# Altium schematic sheet 电气拓扑.SchDoc
size 1270 x 1270 mm; SheetNumber: 1; SheetTotal: 2
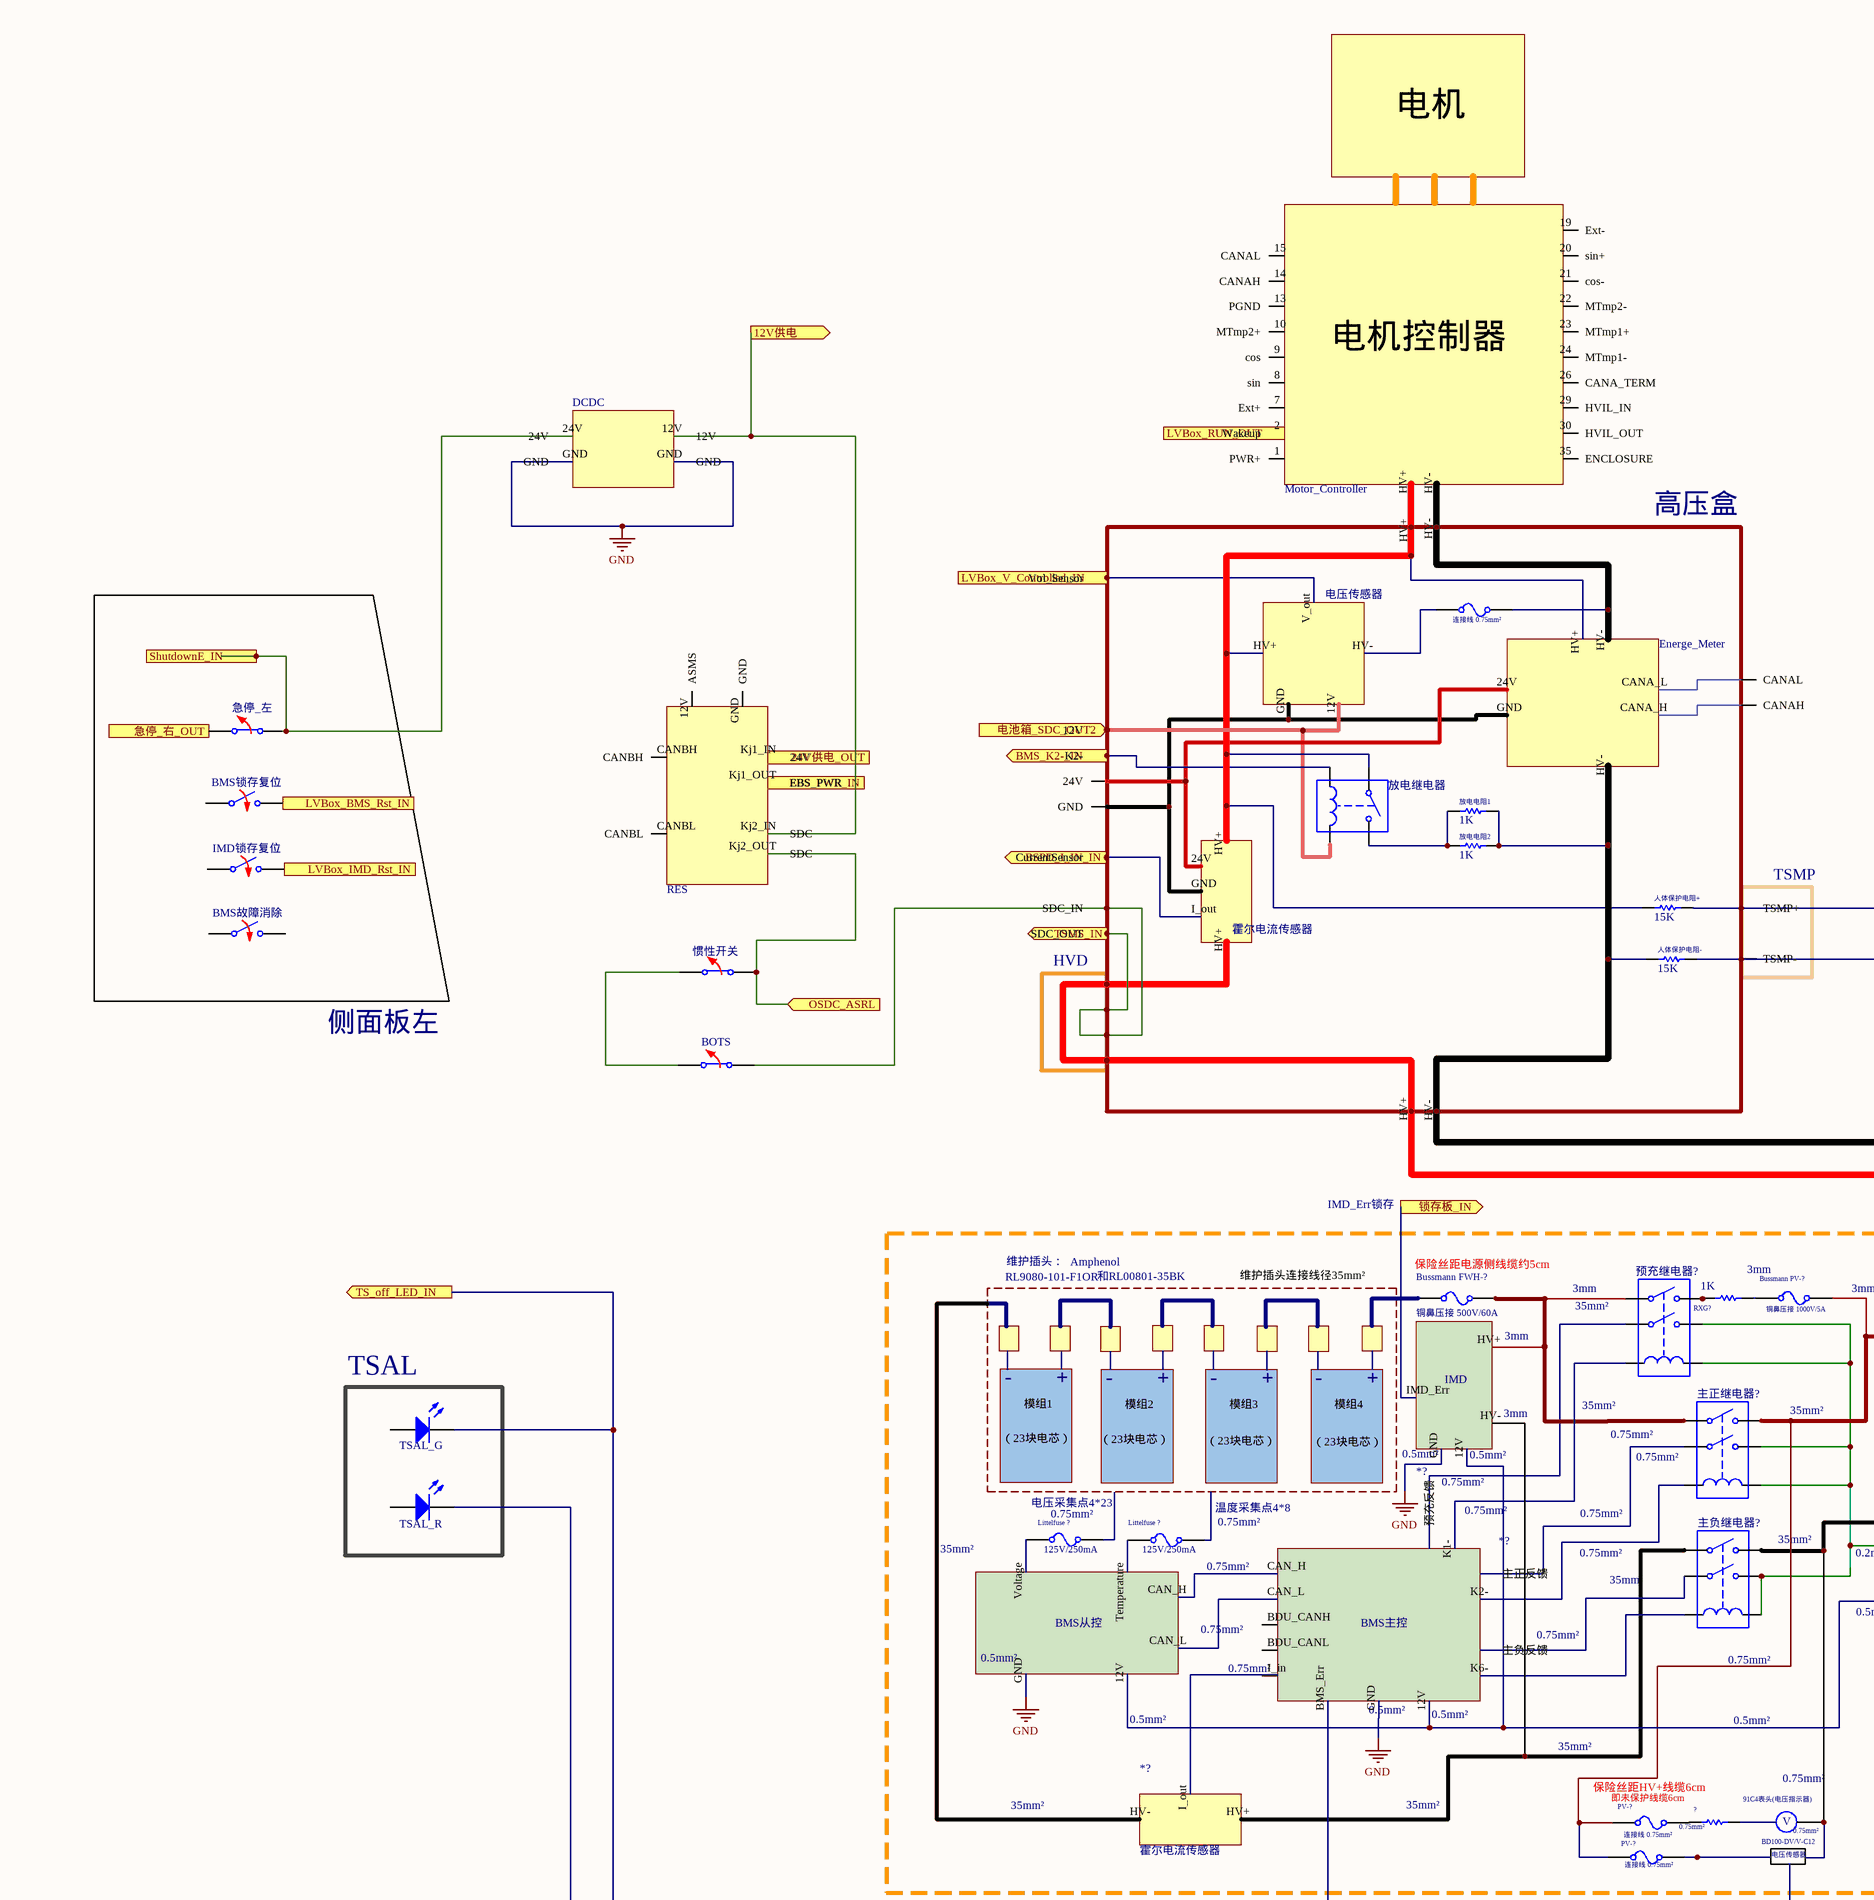
[diagram p0: 电气拓扑.SchDoc, top left]
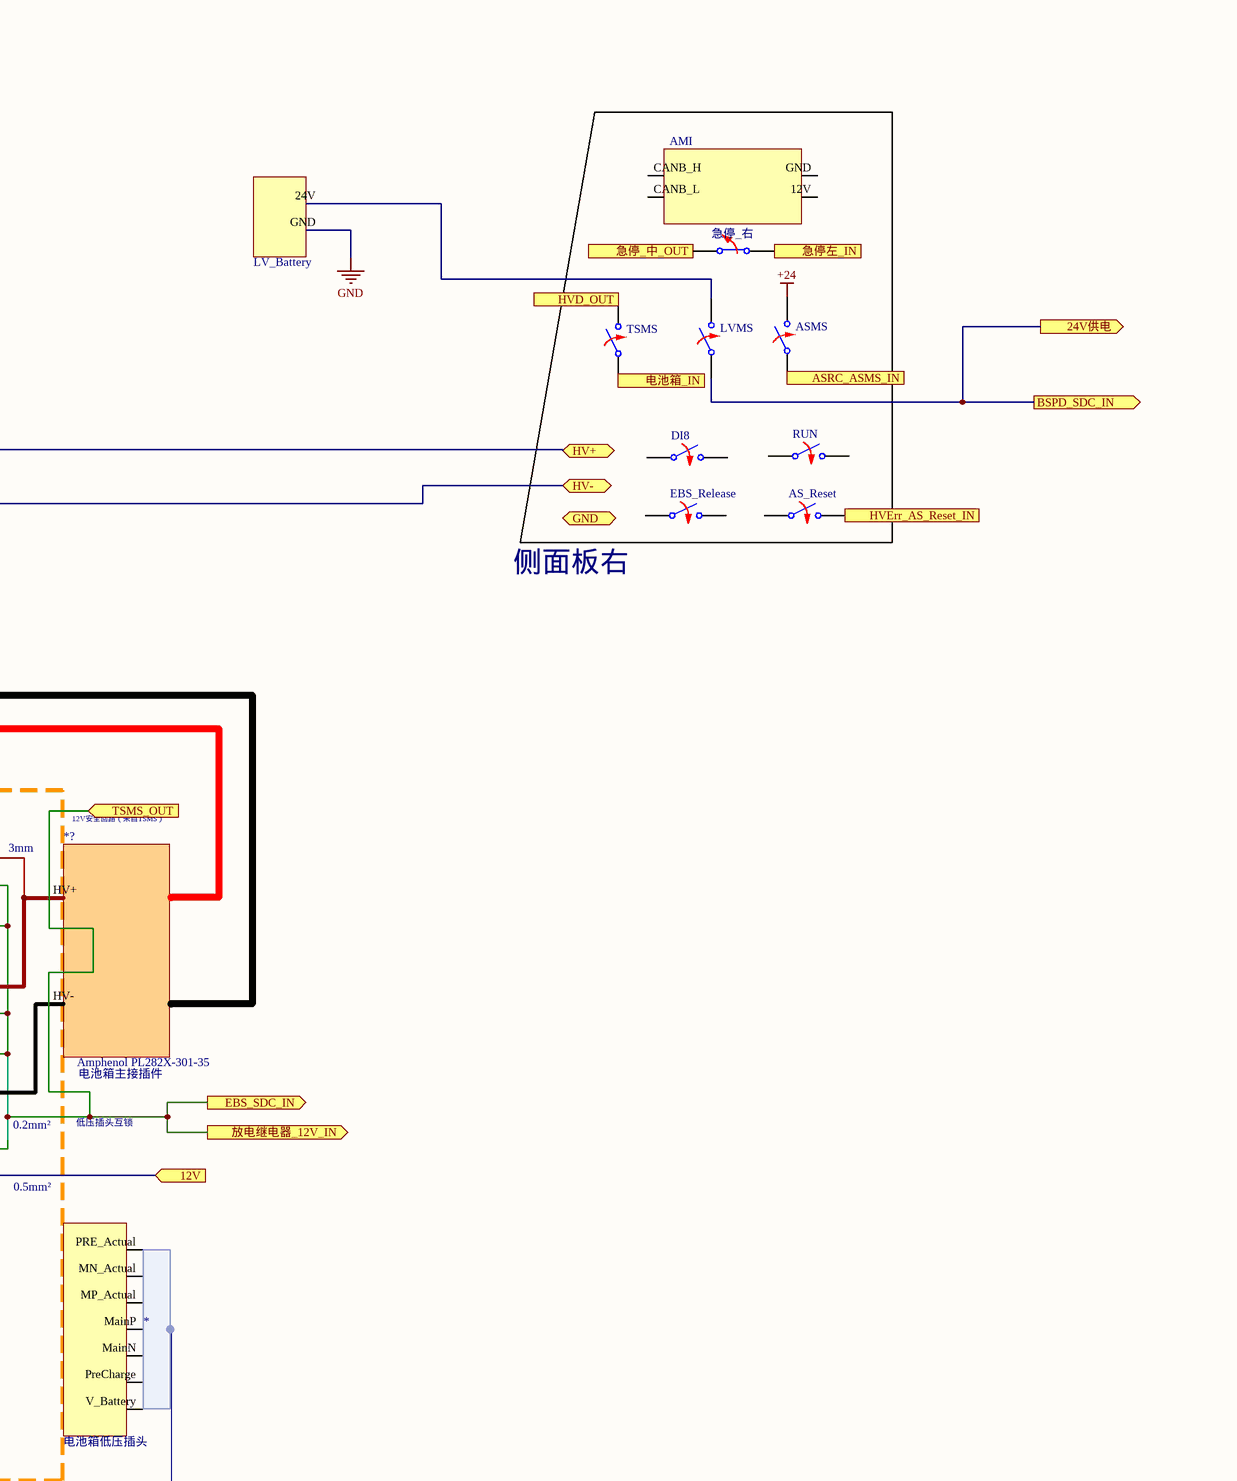
[diagram p1: 电气拓扑.SchDoc, top right]
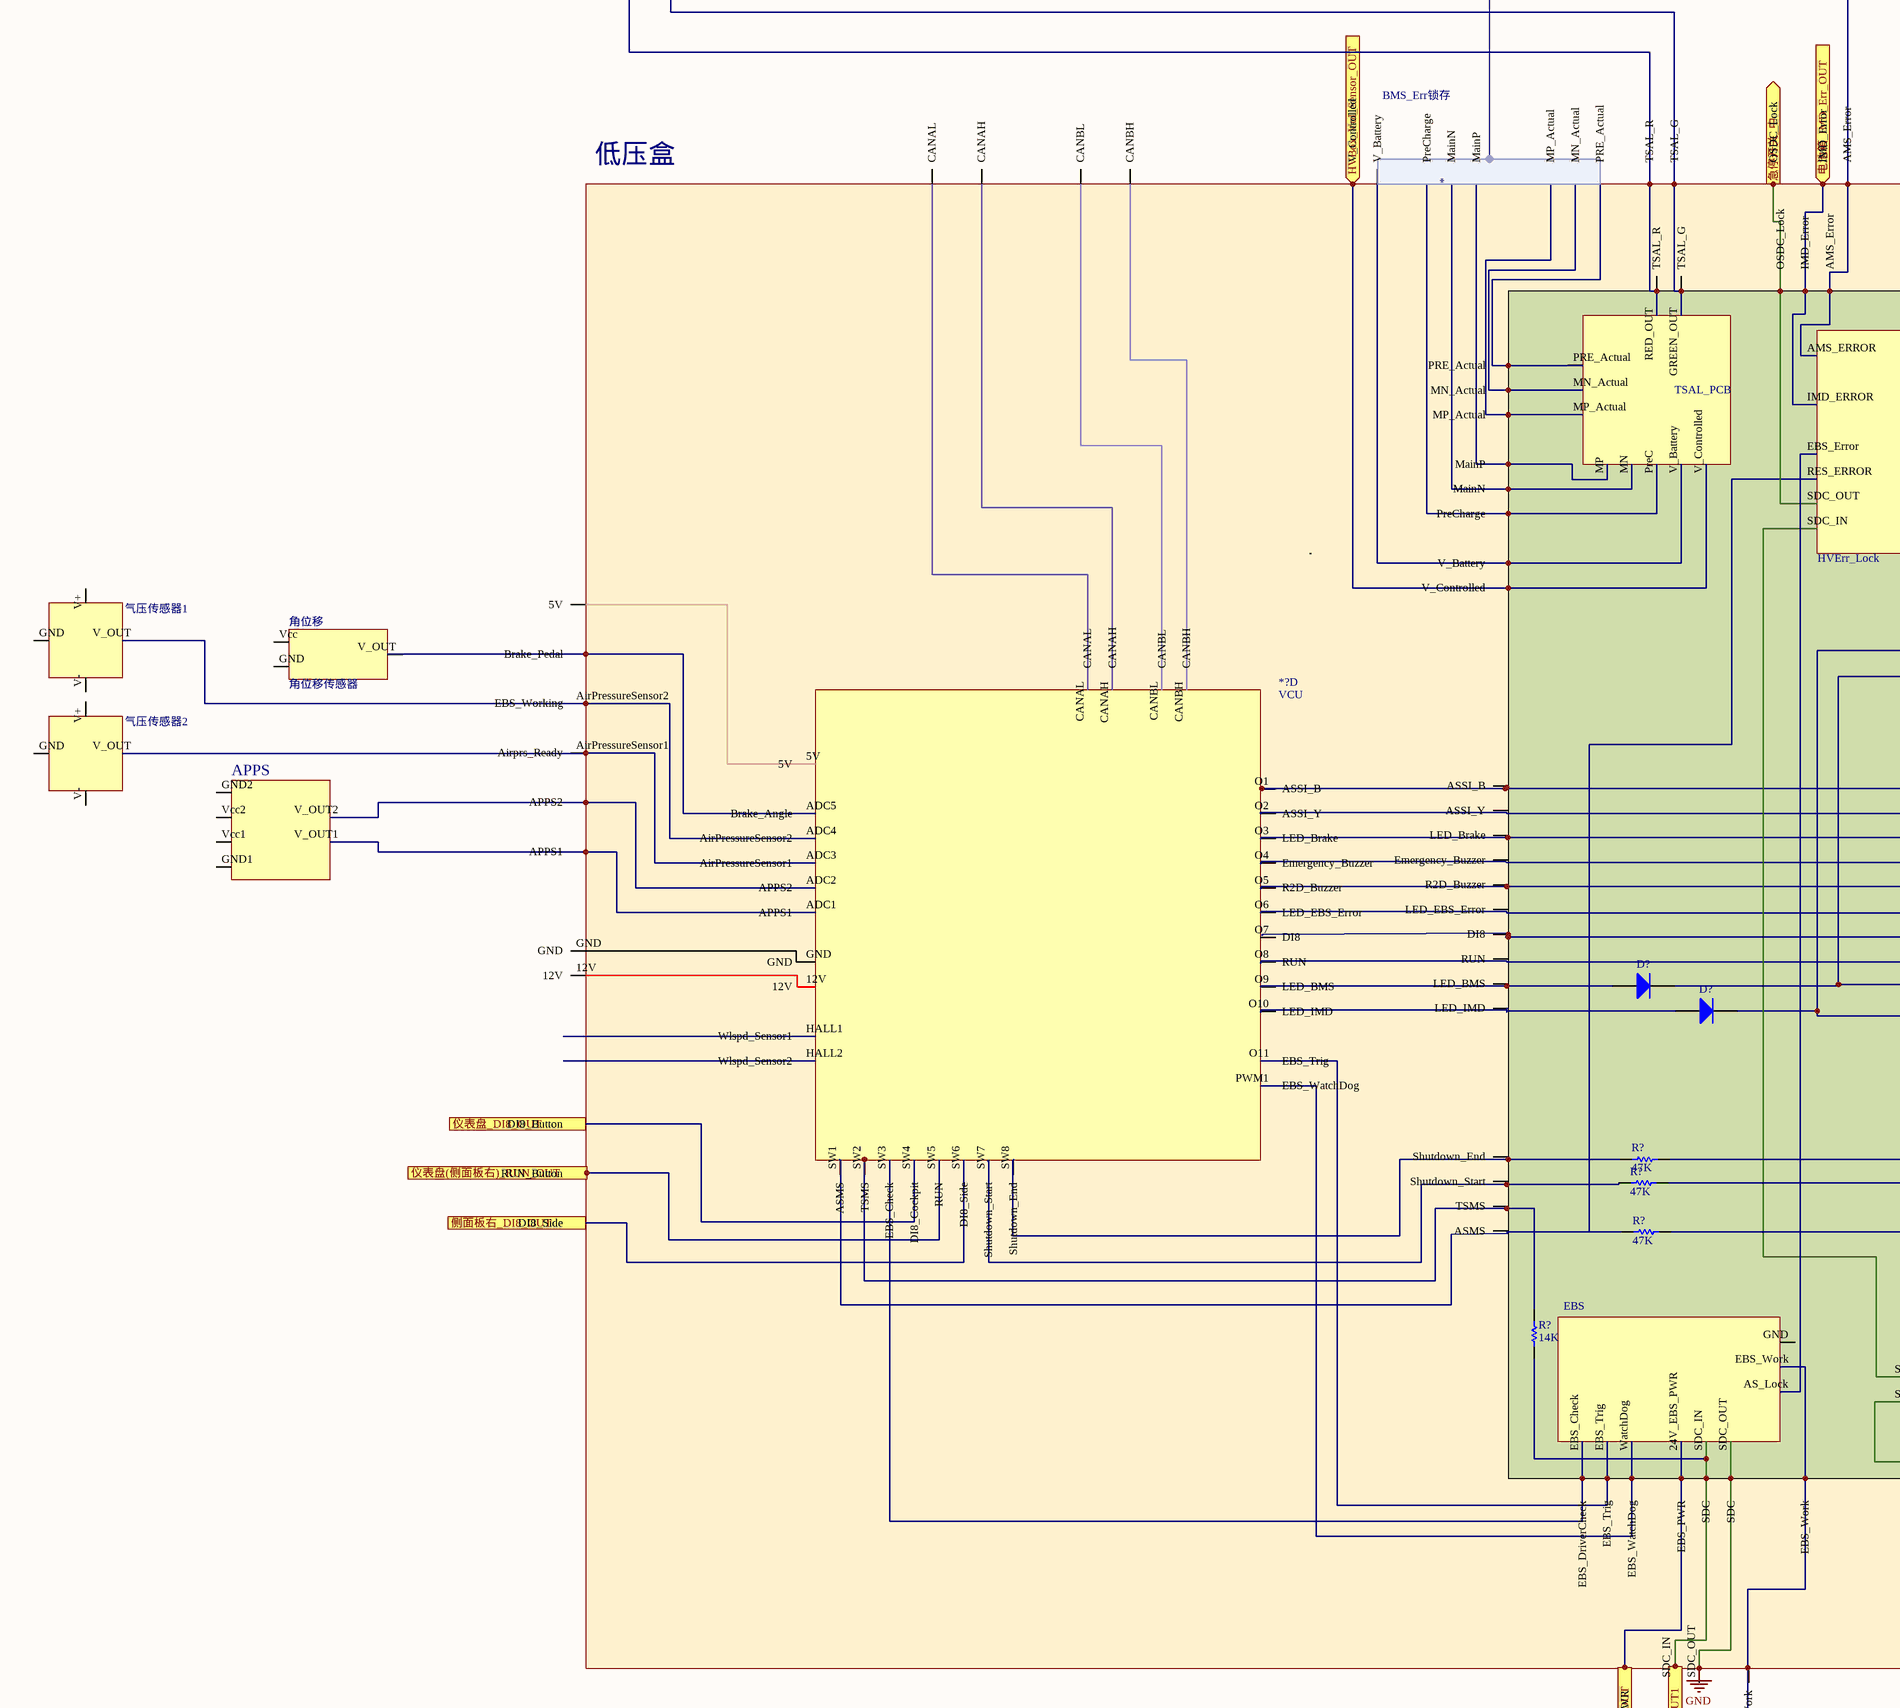
[diagram p2: 电气拓扑.SchDoc, centre left]
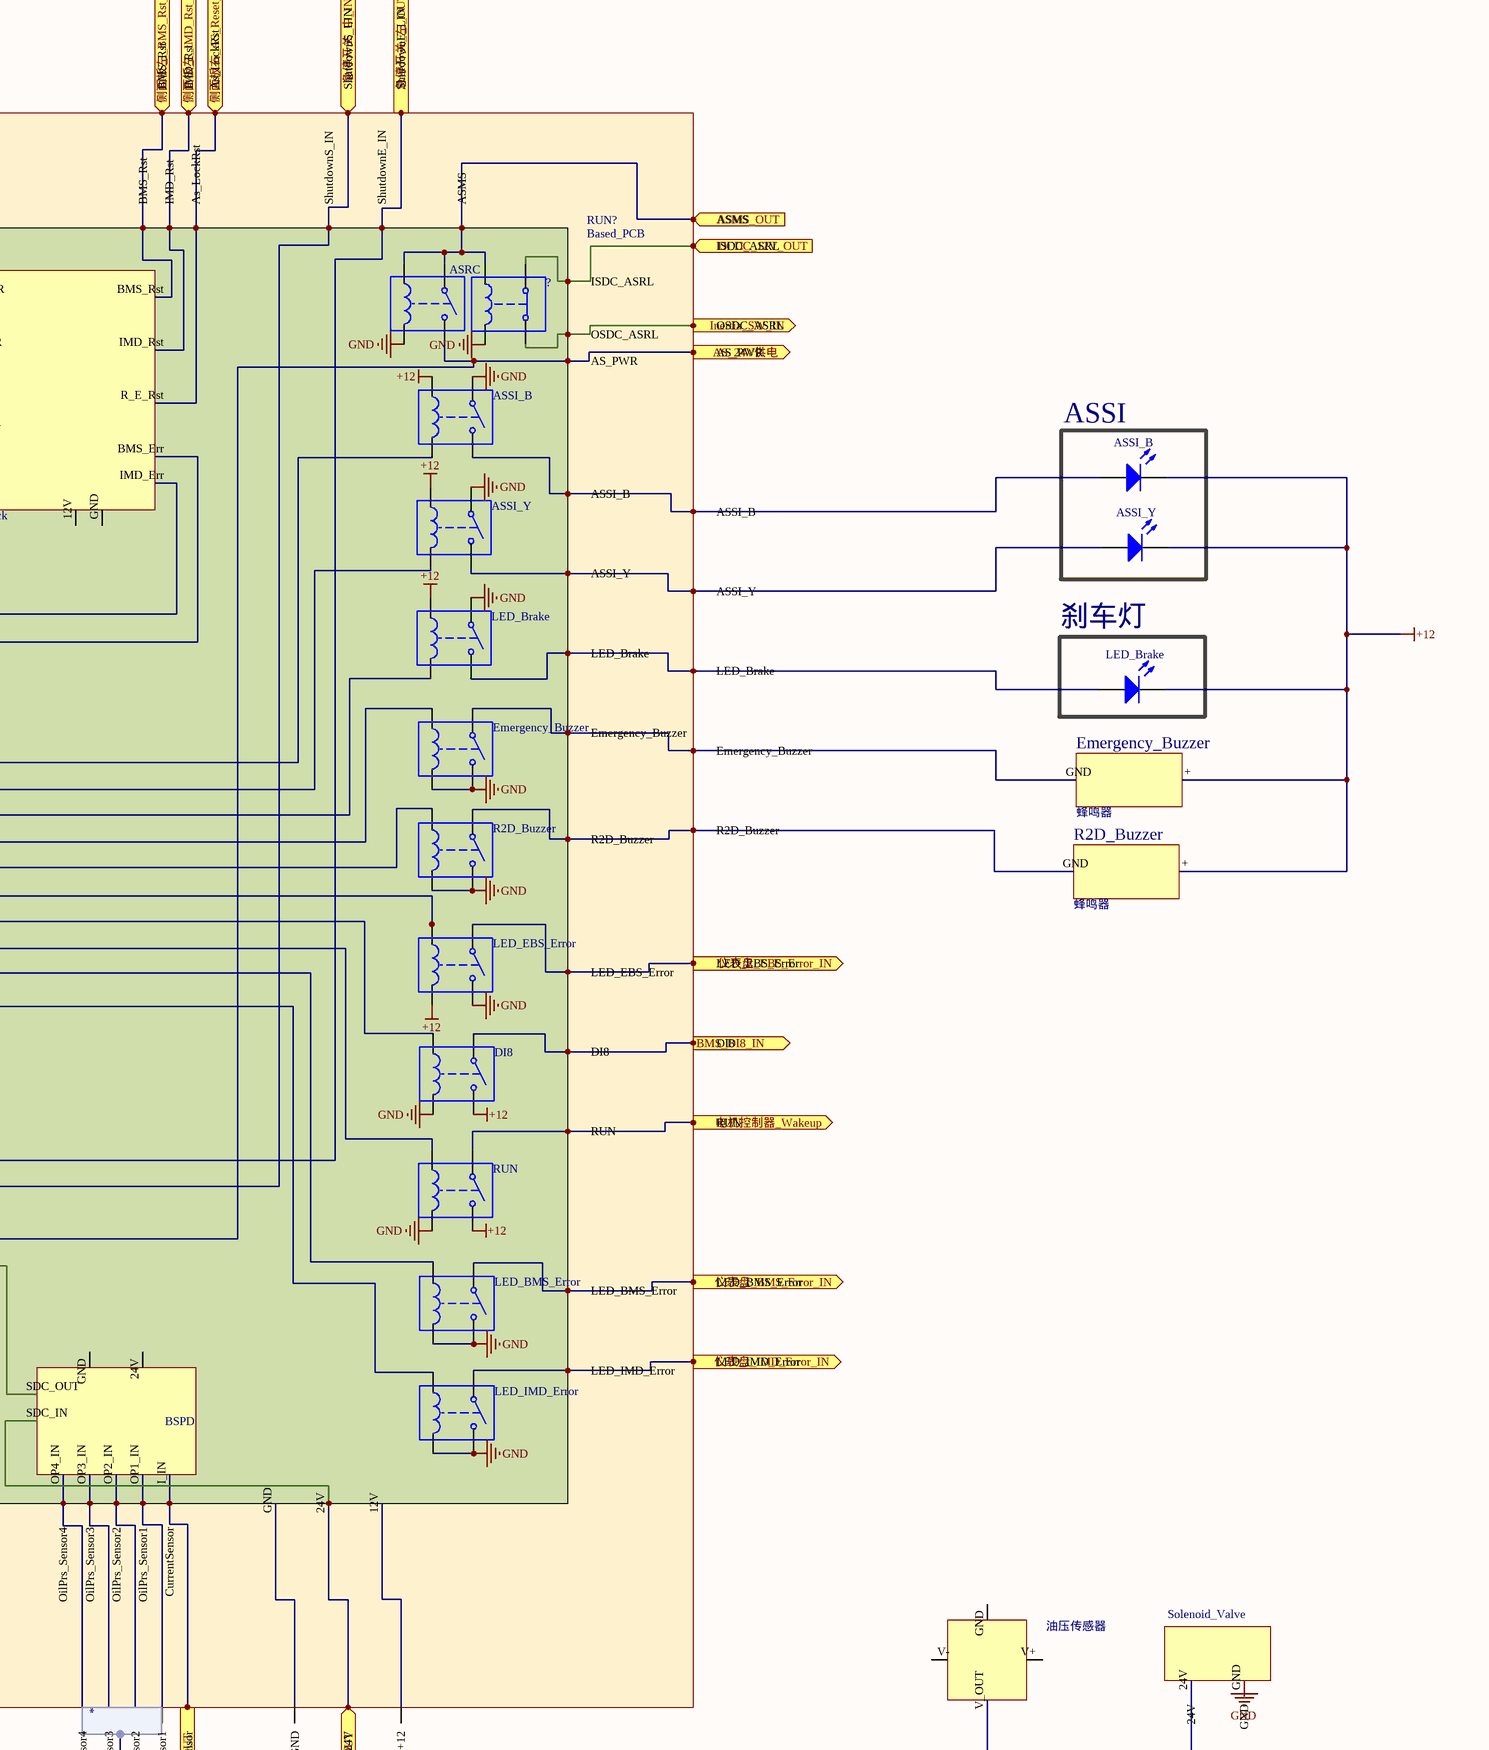
[diagram p3: 电气拓扑.SchDoc, centre right]
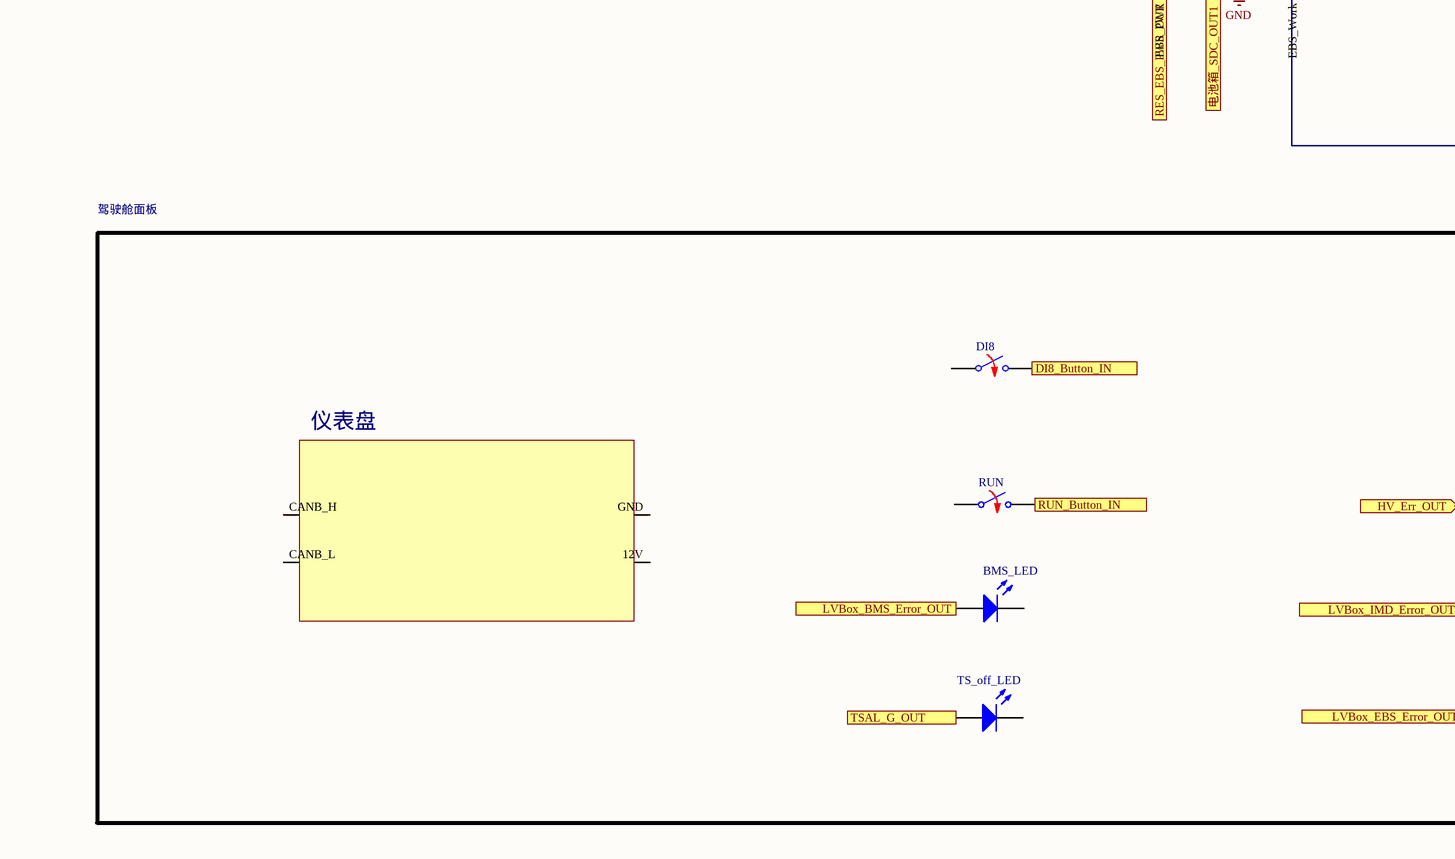
[diagram p4: 电气拓扑.SchDoc, bottom left]
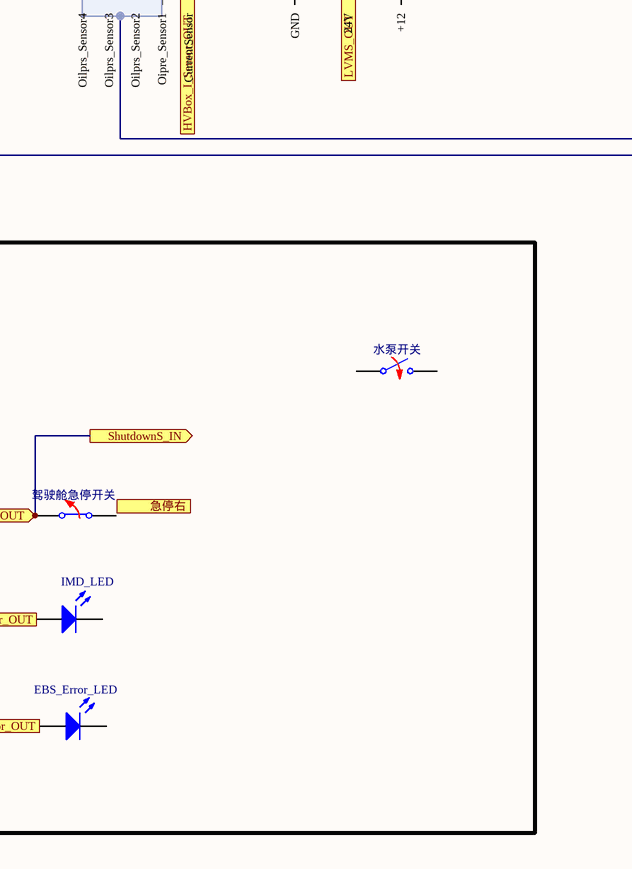
[diagram p5: 电气拓扑.SchDoc, bottom right]

## Parts
(Parts that share a designator on the sheet are numbered #1, #2 ... from top to bottom, then left to right.)
*  气压传感器2
*?#1  IMD
*?#2  Amphenol PL282X-301-35
*?#3  BMS从控
*?#4  BMS主控
*?#5  霍尔电流传感器
*?#6  VCU  (part D of 4)
?#1  侧面板右
?#2  Resistor  (value not drawn)
?#3  Single-Pole, Single-Throw Normally Closed Relay  (value not drawn)
?#4  HVErr_Lock
APPS  APPS  (value not drawn)
AS_Reset  Switch Normally Opened  (value not drawn)
ASMS  Switch Normally Opened  (value not drawn)
ASRC  Single-Pole, Single-Throw Normally Opened Relay  (value not drawn)
ASSI_B#1  Single-Pole, Single-Throw Normally Opened Relay  (value not drawn)
ASSI_B#2  Light-Emitting Diode  (value not drawn)
ASSI_Y#1  Single-Pole, Single-Throw Normally Opened Relay  (value not drawn)
ASSI_Y#2  Light-Emitting Diode  (value not drawn)
BMS_LED  Light-Emitting Diode  (value not drawn)
BMS故障消除  Switch Normally Opened  (value not drawn)
BMS锁存复位  Switch Normally Opened  (value not drawn)
BOTS  Switch Normally Closed  (value not drawn)
BSPD  BSPD  (value not drawn)
Bussmann_FWH-?  Fuse  (value not drawn)
Bussmann_PV-?  Fuse  (value not drawn)
D?#1  Diode  (value not drawn)
D?#2  Diode  (value not drawn)
DCDC  DCDC
DI8#1  Switch Normally Opened  (value not drawn)
DI8#2  Single-Pole, Single-Throw Normally Opened Relay  (value not drawn)
DI8#3  Switch Normally Opened  (value not drawn)
EBS  EBS_Driver  (value not drawn)
EBS_Error_LED  Light-Emitting Diode  (value not drawn)
EBS_Release  Switch Normally Opened  (value not drawn)
Emergency_Buzzer#1  Single-Pole, Single-Throw Normally Opened Relay  (value not drawn)
Emergency_Buzzer#2  蜂鸣器
HV_Box  高压盒
HVBox_BMS_Error_OUT  驾驶舱面板
IMD_LED  Light-Emitting Diode  (value not drawn)
IMD锁存复位  Switch Normally Opened  (value not drawn)
LED_BMS_Error  Single-Pole, Single-Throw Normally Opened Relay  (value not drawn)
LED_Brake#1  Single-Pole, Single-Throw Normally Opened Relay  (value not drawn)
LED_Brake#2  Light-Emitting Diode  (value not drawn)
LED_EBS_Error  Single-Pole, Single-Throw Normally Opened Relay  (value not drawn)
LED_IMD_Error  Single-Pole, Single-Throw Normally Opened Relay  (value not drawn)
Littelfuse_?#1  CURRENT: 125V/250mA  (hidden comment: Fuse)
Littelfuse_?#2  CURRENT: 125V/250mA  (hidden comment: Fuse)
LVMS  Switch Normally Opened  (value not drawn)
PV  连接线 0.75mm²
PV-?#1  连接线 0.75mm²
PV-?#2  连接线 0.75mm²
R2D_Buzzer#1  Single-Pole, Single-Throw Normally Opened Relay  (value not drawn)
R2D_Buzzer#2  蜂鸣器
R?#1  value 47K  (hidden comment: Resistor)
R?#2  value 47K  (hidden comment: Resistor)
R?#3  value 47K  (hidden comment: Resistor)
R?#4  value 14K  (hidden comment: Resistor)
RES  RES
RUN#1  Switch Normally Opened  (value not drawn)
RUN#2  Single-Pole, Single-Throw Normally Opened Relay  (value not drawn)
RUN#3  Switch Normally Opened  (value not drawn)
RUN?  Based_PCB
RXG?  value 1K  (hidden comment: Resistor)
TS_off_LED  Light-Emitting Diode  (value not drawn)
TSAL_G  Light-Emitting Diode  (value not drawn)
TSAL_PCB  TSAL_PCB  (value not drawn)
TSAL_R  Light-Emitting Diode  (value not drawn)
TSMS  Switch Normally Opened  (value not drawn)
主正继电器?  Double-Pole, Single-Throw Relay  (value not drawn)
主负继电器?  Double-Pole, Single-Throw Relay  (value not drawn)
人体保护电阻+  value 15K  (hidden comment: Resistor)
人体保护电阻-  value 15K  (hidden comment: Resistor)
低压电池  LV_Battery
低压盒  LV_Box  (value not drawn)
侧面板左  侧面板左
急停_右  Switch Normally Closed  (value not drawn)
急停_左  Switch Normally Closed  (value not drawn)
惯性开关  Switch Normally Closed  (value not drawn)
放电电阻1  value 1K  (hidden comment: Resistor)
放电电阻2  value 1K  (hidden comment: Resistor)
放电继电器  Single-Pole, Single-Throw Normally Opened Relay  (value not drawn)
气压传感器1  (no value)
水泵开关  Switch Normally Opened  (value not drawn)
油压传感器  油压传感器
电压传感器  电压传感器
电机控制器  Motor_Controller
电池箱低压插头  电池箱低压插头
电流传感器  霍尔电流传感器
电磁阀  Solenoid_Valve
能量计  Energe_Meter
角位移  角位移传感器
预充继电器?  Double-Pole, Single-Throw Relay  (value not drawn)
驾驶舱急停开关  Switch Normally Closed  (value not drawn)

## Blocks framed on the sheet
TSAL: TSAL_G TSAL_R
ASSI: ASSI_B#2 ASSI_Y#2
刹车灯: LED_Brake#2

## Ports
12V (in), 12V供电 (out), 24V供电 (out), 24V供电_OUT (in), AS_24V供电 (out), ASMS_OUT (in), ASRC_ASMS_IN (out), BMS_DI8_IN (out), BMS_K2-_IN (out), BSPD_I_IN_IN (out), BSPD_SDC_IN (out), DCDC_12V_OUT (in), DI8_Button_IN (out), EBS_PWR_IN (out), EBS_SDC_IN (out), GND (bidir), HV+ (bidir), HV- (bidir), HV_Err_OUT (in), HVBox_I_Sensor_OUT (in), HVBox_Vol_Sensor_OUT (in), HVD_OUT (in), HVErr_AS_Reset_IN (out), Inertia_SW_IN (out), LVBox_BMS_Error_OUT (in), LVBox_BMS_Rst_IN (out), LVBox_EBS_Error_OUT (in), LVBox_IMD_Error_OUT, LVBox_IMD_Rst_IN (out), LVBox_RUN_OUT, LVBox_V_Controlled_IN (out), LVMS_OUT (in), OSDC_ASRL (in), RES_EBS_PWR_OUT (in), RUN_Button_IN (out), ShutdownE_IN (in), ShutdownS_IN (out), TS_off_LED_IN (out), TSAL_G_OUT (in), TSMS_IN (out), TSMS_OUT (in), 仪表盘(侧面板右)_RUN_OUT (in), 仪表盘_BMS_Error_IN (out), 仪表盘_DI8_OUT (in), 仪表盘_EBS_Error_IN (out), 仪表盘_IMD_Error_IN (out), 侧面板右_AS_Reset_OUT (in), 侧面板右_DI8_OUT, 侧面板左_BMS_Rst_OUT (in), 侧面板左_IMD_Rst_OUT (in), 急停_中_OUT (in), 急停_右_OUT (in), 急停右 (out), 急停左_IN (out), 急停开关_中 (out), 急停开关_中_IN (in), 急停开关_左_OUT (out), 放电继电器_12V_IN (out), 电机控制器_Wakeup (out), 电池箱_IMD_Err_OUT (in), 电池箱_IN (out), 电池箱_SDC_OUT1 (in), 电池箱_SDC_OUT2 (in), 锁存板_IN (out)

## Harnesses
*: 

## Nets
+12: ASSI_B#1.3 ASSI_B#2.2(K) ASSI_Y#1.3 ASSI_Y#2.2(K) DI8#2.2 Emergency_Buzzer#2.+ LED_Brake#1.3 LED_Brake#2.2(K) LED_EBS_Error.4 R2D_Buzzer#2.+ RUN#2.2
+24: ASMS.2
GND: *?#1.GND *?#3.GND *?#4.GND ?#3.4 ASRC.4 ASSI_B#1.1 ASSI_Y#1.1 DCDC.GND DI8#2.4 EBS.SDC_OUT Emergency_Buzzer#1.2 Emergency_Buzzer#1.4 LED_BMS_Error.2 LED_BMS_Error.4 LED_Brake#1.1 LED_EBS_Error.2 LED_IMD_Error.2 LED_IMD_Error.4 R2D_Buzzer#1.2 R2D_Buzzer#1.4 RUN#2.4 RUN?.?2(SDC) 低压电池.GND 低压盒.SDC_OUT 电磁阀.GND
12V: *?#1.12V *?#3.12V *?#4.12V ; port 12V
12V供电: DCDC.12V RES.Kj2_IN(SDC) ; port 12V供电
24V供电: LVMS.1 ; port BSPD_SDC_IN, port 24V供电
24V供电_OUT: RES.Kj1_IN(24V) ; port 24V供电_OUT
AS_24V供电: ASRC.2 R?#3.2 RUN?.?33(AS_PWR) 低压盒.?27(AS_PWR) ; port AS_24V供电
ASMS_OUT: ?#3.3 ASRC.1 ASRC.3 RUN?.?32(ASMS) 低压盒.?24(ASMS) ; port ASMS_OUT
ASRC_ASMS_IN: ASMS.1 ; port ASRC_ASMS_IN
BMS_DI8_IN: DI8#2.1 RUN?.?42(DI8) 低压盒.?34(DI8) ; port BMS_DI8_IN
BMS_K2-_IN: HV_Box.Vol_Sensor(K2-) 放电继电器.3 ; port BMS_K2-_IN
BSPD_I_IN_IN: HV_Box.CurrentSensor 电流传感器.I_out ; port BSPD_I_IN_IN
DCDC_12V_OUT: ?#3.1 RUN?.?34(ISDC_ASRL) 低压盒.?25(ISDC_ASRL) ; port DCDC_12V_OUT
DI8_Button_IN: DI8#3.2 ; port DI8_Button_IN
EBS_PWR_IN: RES.Kj1_OUT(EBS_PWR) ; port EBS_PWR_IN
EBS_SDC_IN: 主正继电器?.4 主正继电器?.6 主负继电器?.4 主负继电器?.6 预充继电器?.4 预充继电器?.6 ; port TSMS_OUT, port EBS_SDC_IN, port 放电继电器_12V_IN
HV+: HV_Box.?1(TSMP+) 人体保护电阻+.1 ; port HV+
HV-: HV_Box.?2(TSMP-) 人体保护电阻-.1 ; port HV-
HV_Err_OUT: 驾驶舱急停开关.1 ; port HV_Err_OUT, port ShutdownS_IN
HVBox_I_Sensor_OUT: BSPD.I_IN RUN?.?7(CurrentSensor) 低压盒.?40(CurrentSensor) ; port HVBox_I_Sensor_OUT
HVBox_Vol_Sensor_OUT: RUN?.?13(V_Controlled) TSAL_PCB.V_Controlled 低压盒.?50(V_Controlled) ; port HVBox_Vol_Sensor_OUT
HVD_OUT: TSMS.2 ; port HVD_OUT
HVErr_AS_Reset_IN: AS_Reset.2 ; port HVErr_AS_Reset_IN
Inertia_SW_IN: ?#3.2 RUN?.?35(OSDC_ASRL) 低压盒.?26(OSDC_ASRL) ; port Inertia_SW_IN
LVBox_BMS_Rst_IN: BMS锁存复位.2 ; port LVBox_BMS_Rst_IN
LVBox_EBS_Error_OUT: EBS_Error_LED.1(A) ; port LVBox_EBS_Error_OUT
LVBox_IMD_Rst_IN: IMD锁存复位.2 ; port LVBox_IMD_Rst_IN
LVBox_RUN_OUT: 电机控制器.2(Wakeup) ; port LVBox_RUN_OUT
LVBox_V_Controlled_IN: HV_Box.Vol_Sensor 电压传感器.V_out ; port LVBox_V_Controlled_IN
LVMS_OUT: BSPD.SDC_IN RUN?.24V 低压盒.24V ; port LVMS_OUT
OSDC_ASRL: RES.Kj2_OUT(SDC) 惯性开关.2 ; port OSDC_ASRL
RES_EBS_PWR_OUT: EBS.24V_EBS_PWR RUN?.?44(EBS_PWR) 低压盒.?36(EBS_PWR) ; port RES_EBS_PWR_OUT
RUN_Button_IN: RUN#3.2 ; port RUN_Button_IN
ShutdownE_IN: DCDC.24V 急停_左.2 ; port ShutdownE_IN
TS_off_LED_IN: RUN?.?26(TSAL_G) TSAL_G.2(K) TSAL_PCB.GREEN_OUT 低压盒.?18(TSAL_G) ; port TS_off_LED_IN
TSAL_G_OUT: TS_off_LED.1(A) ; port TSAL_G_OUT
TSMS_IN: BOTS.2 HV_Box.HVD+ HV_Box.HVD- HV_Box.SDCIL_I(SDC_IN) HV_Box.SDCIL_O(SDC_OUT) ; port TSMS_IN
仪表盘(侧面板右)_RUN_OUT: *?#6.SW5(RUN) 低压盒.?5(RUN_Button) ; port 仪表盘(侧面板右)_RUN_OUT
仪表盘_BMS_Error_IN: LED_BMS_Error.1 RUN?.?53(LED_BMS_Error) 低压盒.?48(LED_BMS_Error) ; port 仪表盘_BMS_Error_IN
仪表盘_DI8_OUT: *?#6.SW4(DI8_Cockpit) 低压盒.?4(DI8_Button) ; port 仪表盘_DI8_OUT
仪表盘_EBS_Error_IN: LED_EBS_Error.1 RUN?.?41(LED_EBS_Error) 低压盒.?33(LED_EBS_Error) ; port 仪表盘_EBS_Error_IN
仪表盘_IMD_Error_IN: LED_IMD_Error.1 RUN?.?54(LED_IMD_Error) 低压盒.?49(LED_IMD_Error) ; port 仪表盘_IMD_Error_IN
侧面板右_AS_Reset_OUT: ?#4.R_E_Rst RUN?.?57(As_LockRst) 低压盒.?22(As_LockRst) ; port 侧面板右_AS_Reset_OUT
侧面板右_DI8_OUT: *?#6.SW6(DI8_Side) 低压盒.?43(DI8_Side) ; port 侧面板右_DI8_OUT
侧面板左_BMS_Rst_OUT: ?#4.BMS_Rst RUN?.?31(BMS_Rst) 低压盒.?23(BMS_Rst) ; port 侧面板左_BMS_Rst_OUT
侧面板左_IMD_Rst_OUT: ?#4.IMD_Rst RUN?.?30(IMD_Rst) 低压盒.?42(IMD_Rst) ; port 侧面板左_IMD_Rst_OUT
急停_中_OUT: 急停_右.1 ; port 急停_中_OUT
急停_右_OUT: 急停_左.1 ; port 急停_右_OUT
急停开关_中: ?#4.SDC_OUT RUN?.?29(OSDC_Lock) 低压盒.?19(OSDC_Lock) ; port 急停开关_中
急停开关_中_IN: R?#2.2 RUN?.?49(ShutdownS_IN) 低压盒.?46(ShutdownS_LIN) ; port 急停开关_中_IN
急停开关_左_OUT: R?#1.2 RUN?.?50(ShutdownE_IN) 低压盒.?47(ShutdownE_LIN) ; port 急停开关_左_OUT
电机控制器_Wakeup: RUN#2.1 RUN?.?43(RUN) 低压盒.?35(RUN) ; port 电机控制器_Wakeup
电池箱_IMD_Err_OUT: ?#4.IMD_ERROR RUN?.?27(IMD_Error) 低压盒.?21(IMD_Error) ; port 电池箱_IMD_Err_OUT
电池箱_IN: TSMS.1 ; port 电池箱_IN
电池箱_SDC_OUT1: EBS.SDC_IN R?#4.1 RUN?.?1(SDC) 低压盒.SDC_IN ; port 电池箱_SDC_OUT1
电池箱_SDC_OUT2: HV_Box.12V 放电继电器.4 电压传感器.12V ; port 电池箱_SDC_OUT2
锁存板_IN: *?#1.IMD_Err ; port 锁存板_IN
Net*?#1_HV+: *?#1.HV+ Bussmann_FWH-?.2 主正继电器?.1 预充继电器?.1
Net*?#1_HV-: *?#1.HV- *?#5.HV+ 主负继电器?.1
Net*?#2_HV+: *?#2.HV+ Bussmann_PV-?.2 PV-?#1.1 PV-?#2.1 主正继电器?.2
Net*?#2_HV-: *?#2.HV- 主负继电器?.2
Net*?#3_CAN_H: *?#3.CAN_H *?#4.CAN_H
Net*?#3_CAN_L: *?#3.CAN_L *?#4.CAN_L
Net*?#3_Temperature: *?#3.Temperature Littelfuse_?#2.1
Net*?#3_Voltage: *?#3.Voltage Littelfuse_?#1.1
Net*?#4_?1: *?#4.?1(主负反馈) 主负继电器?.3
Net*?#4_?2: *?#4.?2(主正反馈) 主正继电器?.3
Net*?#4_?3: *?#4.?3(预充反馈) 预充继电器?.3
Net*?#4_BMS_Err: *?#4.BMS_Err ?#4.AMS_ERROR RUN?.?28(AMS_Error) 低压盒.?20(AMS_Error)
Net*?#4_I_in: *?#4.I_in *?#5.I_out
Net*?#4_K1-: *?#4.K1- 预充继电器?.5
Net*?#4_K2-: *?#4.K2- 主正继电器?.5
Net*?#4_K6-: *?#4.K6- 主负继电器?.5
Net*?#6_5V: *?#6.5V 低压盒.?41(5V)
Net*?#6_12V: *?#6.12V 低压盒.12V
Net*?#6_ADC1: *?#6.ADC1(APPS1) APPS.V_OUT1 低压盒.?3(APPS1)
Net*?#6_ADC2: *?#6.ADC2(APPS2) APPS.V_OUT2 低压盒.?2(APPS2)
Net*?#6_ADC4: *?#6.ADC4(AirPressureSensor2) 低压盒.AirPressureSensor2(EBS_Working) 气压传感器1.V_OUT
Net*?#6_ADC5: *?#6.ADC5(Brake_Angle) 低压盒.?1(Brake_Pedal) 角位移.V_OUT
Net*?#6_CANAH: *?#6.CANAH 低压盒.?7(CANAH)
Net*?#6_CANAL: *?#6.CANAL 低压盒.?6(CANAL)
Net*?#6_CANBH: *?#6.CANBH 低压盒.?9(CANBH)
Net*?#6_CANBL: *?#6.CANBL 低压盒.?8(CANBL)
Net*?#6_GND: *?#6.GND 低压盒.GND
Net*?#6_O1: *?#6.O1(ASSI_B) ASSI_B#1.4 RUN?.?17(ASSI_B)
Net*?#6_O2: *?#6.O2(ASSI_Y) ASSI_Y#1.4
Net*?#6_O3: *?#6.O3(LED_Brake) LED_Brake#1.4
Net*?#6_O4: *?#6.O4(Emergency_Buzzer) Emergency_Buzzer#1.3
Net*?#6_O5: *?#6.O5(R2D_Buzzer) R2D_Buzzer#1.3
Net*?#6_O6: *?#6.O6(LED_EBS_Error) LED_EBS_Error.3
Net*?#6_O8: *?#6.O8(RUN) RUN#2.3
Net*?#6_O9: *?#6.O9(LED_BMS) D?#1.1(A)
Net*?#6_O10: *?#6.O10(LED_IMD) D?#2.1(A) RUN?.?56(LED_IMD)
Net*?#6_O11: *?#6.O11(EBS_Trig) EBS.EBS_Trig RUN?.?4(EBS_Trig)
Net*?#6_PWM1: *?#6.PWM1(EBS_WatchDog) EBS.WatchDog RUN?.?5(EBS_WatchDog)
Net*?#6_SW1: *?#6.SW1(ASMS) ?#4.RES_ERROR R?#3.1
Net*?#6_SW2: *?#6.SW2(TSMS) R?#4.2
Net*?#6_SW3: *?#6.SW3(EBS_Check) EBS.EBS_Check RUN?.?3(EBS_DriverCheck)
Net*?#6_SW8: *?#6.SW8(Shutdown_End) R?#1.1 RUN?.?52(Shutdown_End)
Net*_V_OUT: *.V_OUT *?#6.ADC3(AirPressureSensor1) 低压盒.AirPressureSensor1(Airprs_Ready)
Net?#4_BMS_Err: ?#4.BMS_Err D?#1.2(K) LED_BMS_Error.3
Net?#4_EBS_Error: ?#4.EBS_Error EBS.AS_Lock(WatchDog)
Net?#4_IMD_Err: ?#4.IMD_Err D?#2.2(K) LED_IMD_Error.3
Net?#4_SDC_IN: ?#4.SDC_IN BSPD.SDC_OUT
NetASSI_B#1_2: ASSI_B#1.2 ASSI_B#2.1(A) RUN?.?36(ASSI_B) 低压盒.?28(ASSI_B)
NetASSI_Y#1_2: ASSI_Y#1.2 ASSI_Y#2.1(A) RUN?.?37(ASSI_Y) 低压盒.?29(ASSI_Y)
NetBOTS_1: BOTS.1 惯性开关.1
NetBSPD_OP1_IN: BSPD.OP1_IN RUN?.?8(OilPrs_Sensor1) 低压盒.?39(Oipre_Sensor1)
NetBSPD_OP2_IN: BSPD.OP2_IN RUN?.?9(OilPrs_Sensor2) 低压盒.?44(Oilprs_Sensor2)
NetBSPD_OP3_IN: BSPD.OP3_IN RUN?.?47(OilPrs_Sensor3) 低压盒.?38(Oilprs_Sensor3)
NetBSPD_OP4_IN: BSPD.OP4_IN RUN?.?48(OilPrs_Sensor4) 低压盒.?45(Oilprs_Sensor4)
NetBussmann_PV-?_1: Bussmann_PV-?.1 RXG?.2
NetDI8#2_3: DI8#2.3 RUN?.?23(DI8)
NetEBS_EBS_Work: EBS.EBS_Work RUN?.?6(EBS_Work) 低压盒.?37(EBS_Work) 电磁阀.24V
NetEmergency_Buzzer#1_1: Emergency_Buzzer#1.1 Emergency_Buzzer#2.GND RUN?.?39(Emergency_Buzzer) 低压盒.?31(Emergency_Buzzer)
NetHV_Box_24V: HV_Box.24V 电流传感器.24V(I_out) 能量计.24V
NetHV_Box_?3: HV_Box.?3 HV_Box.?4 HV_Box.HV+ 电流传感器.HV+
NetHV_Box_CANAH: HV_Box.CANAH 能量计.CANA_H
NetHV_Box_CANAL: HV_Box.CANAL 能量计.CANA_L
NetHV_Box_GND: HV_Box.GND 电压传感器.GND 电流传感器.GND 能量计.GND
NetHV_Box_HV+: HV_Box.HV+(Vol_Sensor) 人体保护电阻+.2 放电继电器.1 电压传感器.HV+ 电机控制器.HV+ 电流传感器.HV+ 能量计.HV+
NetHV_Box_HV-: HV_Box.HV-(Vol_Sensor) PV.2 电机控制器.HV- 能量计.HV-
NetHV_Box_HV-: HV_Box.HV- 人体保护电阻-.2 放电电阻1.1 放电电阻2.1 能量计.HV-  [a separate net that carries the same name]
NetLED_Brake#1_2: LED_Brake#1.2 LED_Brake#2.1(A) RUN?.?38(LED_Brake) 低压盒.?30(LED_Brake)
NetLVMS_2: LVMS.2 低压电池.24V
NetPV_1: PV.1 电压传感器.HV-
NetR2D_Buzzer#1_1: R2D_Buzzer#1.1 R2D_Buzzer#2.GND RUN?.?40(R2D_Buzzer) 低压盒.?32(R2D_Buzzer)
NetRUN?_12V: RUN?.12V 低压盒.+12
NetRUN?_?10: RUN?.?10(PRE_Actual) TSAL_PCB.PRE_Actual 低压盒.?16(PRE_Actual)
NetRUN?_?11: RUN?.?11(MN_Actual) TSAL_PCB.MN_Actual 低压盒.?15(MN_Actual)
NetRUN?_?12: RUN?.?12(MP_Actual) TSAL_PCB.MP_Actual 低压盒.?14(MP_Actual)
NetRUN?_?14: RUN?.?14(MainP) TSAL_PCB.MP 低压盒.?12(MainP)
NetRUN?_?15: RUN?.?15(MainN) TSAL_PCB.MN 低压盒.?11(MainN)
NetRUN?_?16: RUN?.?16(PreCharge) TSAL_PCB.PreC 低压盒.?10(PreCharge)
NetRUN?_?25: RUN?.?25(TSAL_R) TSAL_PCB.RED_OUT TSAL_R.2(K) 低压盒.?17(TSAL_R)
NetRUN?_?58: RUN?.?58(V_Battery) TSAL_PCB.V_Battery 低压盒.?13(V_Battery)
NetRUN?_GND: RUN?.GND 低压盒.GND
NetRXG?_1: RXG?.1 预充继电器?.2
Net放电电阻1_2: 放电电阻1.2 放电电阻2.2 放电继电器.2

Not connected (* = marked no-connect by the designer): * GND V+ V-; *?#4 BDU_CANH BDU_CANL; *?#5 HV-; *?#6 HALL1(Wlspd_Sensor1) HALL2(Wlspd_Sensor2) O7(DI8) SW7(Shutdown_Start); ?#1 12V CANB_H CANB_L GND; ?#2 1 2; ?#4 12V GND; APPS GND1 GND2 Vcc1 Vcc2; AS_Reset 1; BMS_LED 1(A) 2(K); BMS故障消除 1 2; BMS锁存复位 1; BSPD 24V GND; Bussmann_FWH-? 1; DI8#1 1 2; DI8#3 1; EBS GND; EBS_Error_LED 2(K); EBS_Release 1 2; HVBox_BMS_Error_OUT 12V CANB_H CANB_L GND; IMD_LED 1(A) 2(K); IMD锁存复位 1; Littelfuse_?#1 2; Littelfuse_?#2 2; PV-?#1 2; PV-?#2 2; R?#2 1; RES 12V(ASMS) CANBH CANBL GND; RUN#1 1 2; RUN#3 1; RUN? ?18(ASSI_Y) ?19(LED_Brake) ?20(Emergency_Buzzer) ?21(R2D_Buzzer) ?22(LED_EBS_Error) ?24(RUN) ?45(ASMS) ?46(TSMS) ?51(Shutdown_Start) ?55(LED_BMS); TS_off_LED 2(K); TSAL_G 1(A); TSAL_R 1(A); 急停_右 2; 气压传感器1 GND V+ V-; 水泵开关 1 2; 油压传感器 GND V+ V- V_OUT; 电机控制器 1(PWR+) 7(Ext+) 8(sin) 9(cos) 10(MTmp2+) 13(PGND) 14(CANAH) 15(CANAL) 19(Ext-) 20(sin+) 21(cos-) 22(MTmp2-) 23(MTmp1+) 24(MTmp1-) 26(CANA_TERM) 29(HVIL_IN) 30(HVIL_OUT) 35(ENCLOSURE); 电池箱低压插头 MainN MainP MN_Actual MP_Actual PRE_Actual PreCharge V_Battery; 角位移 GND Vcc; 驾驶舱急停开关 2

## Notes on the sheet
- 电机
- (near 电机控制器) 电机控制器
- (near HV_Box) TSMP
- (near HV_Box) HVD
- IMD_Err锁存
- RL9080-101-F1OR
- 维护插头：
- Amphenol
- 和RL00801-35BK
- 维护插头连接线径35mm²
- (near Bussmann_FWH-?) 保险丝距电源侧线缆约5cm
- 3mm
- 12V安全回路（来自TSMS）
- (near Bussmann_FWH-?) 铜鼻压接 500V/60A
- (near *?#1) 3mm
- (near 预充继电器?) 35mm²
- (near Bussmann_PV-?) 铜鼻压接 1000V/5A
- -
- 模组1
- +
- 模组2
- 模组3
- (near *?#1) 模组4
- (near *?#1) +
- 35mm²
- （23块电芯）
- (near *?#1) （23块电芯）
- (near *?#1) 0.5mm²
- (near *?#1) 0.75mm²
- 0.75mm²
- (near 主正继电器?) 0.75mm²
- 电压采集点4*23
- (near Littelfuse_?#1) 0.75mm²
- (near *?#4) 温度采集点4*8
- (near *?#4) 0.75mm²
- (near 主负继电器?) 35mm²
- 0.2mm²
- 低压插头互锁
- 电池箱主接插件
- (near *?#3) 0.75mm²
- 0.5mm²
- (near *?#3) 0.5mm²
- (near 主负继电器?) 0.75mm²
- (near *?#4) 0.5mm²
- (near PV-?#1) 保险丝距HV+线缆6cm
- (near PV-?#1) 即未保护线缆6cm
- (near ?#2) 91C4表头(电压指示器)
- (near ?#2) 0.75mm²
- (near ?#2) BD100-DV/V-C12
- 电压传感器
- V
- BMS_Err锁存
- (near 低压盒) 低压盒
- (in symbol 侧面板右) AMI
- (in symbol 驾驶舱面板) 仪表盘

## Library data of the parts
* 气压传感器1 = 油压传感器
?#2 = Resistor: TC1: 0; SimulationGenericComponent: True; Value: 1K; TC2: 0
?#3 = SPST Relay NC: L_C: 1u; R_C: 100; RON: 1; ROFF: 1e12; ION: 1m; IOFF: 0; SimulationGenericComponent: True
AS_Reset ASMS BMS故障消除 BMS锁存复位 DI8#1 DI8#3 EBS_Release IMD锁存复位 LVMS RUN#1 RUN#3 TSMS 水泵开关 = SW NO: closed: 0; Rclosed: 1m; Ropen: 1Meg; SimulationGenericComponent: True
ASRC ASSI_B#1 ASSI_Y#1 DI8#2 Emergency_Buzzer#1 LED_BMS_Error LED_Brake#1 LED_EBS_Error LED_IMD_Error R2D_Buzzer#1 RUN#2 放电继电器 = SPST Relay NO: L_C: 1u; R_C: 100; RON: 1; ROFF: 1e12; ION: 1m; IOFF: 0; SimulationGenericComponent: True
ASSI_B#2 ASSI_Y#2 BMS_LED EBS_Error_LED IMD_LED LED_Brake#2 TS_off_LED TSAL_G TSAL_R = LED: AF: 1; BV: 0; BV_MAX: 1e99; EG: 1.11; FC: 0.5; IBV: 0.001; IS: 1e-14; MJSW: 0.33; NTUN: 30; TNOM: 27; XTI: 3; SimulationGenericComponent: True; CJO: 0; CJP: 0; CTA: 0; CTP: 0; FCS: 0.5; FV_MAX: 1e99; IKF: 0; IKR: 0; ISR: 1e-14; JSW: 0; JTUN: 0; JTUNSW: 0; KEG: 1; KF: 0; LEVEL: 1; N: 1; NBV: 1; NR: 1; NS: 1; PHP: 1; RS: 0; TCV: 0; TLEV: 0; TLEVC: 0; TM1: 0; TM2: 0; TPB: 0; TPHP: 0; TRS: 0; TRS2: 0; TT: 0; TTT1: 0; TTT2: 0; VJ: 1; XTITUN: 3
BOTS 急停_右 急停_左 惯性开关 驾驶舱急停开关 = SW NC: closed: 1; Rclosed: 1m; Ropen: 1Meg; SimulationGenericComponent: True
Bussmann_FWH-? Bussmann_PV-? PV PV-?#1 PV-?#2 = Fuse: RESISTANCE: 1m; SimulationGenericComponent: True; CURRENT: 1
D?#1 D?#2 = Diode: AF: 1; BV: 0; BV_MAX: 1e99; EG: 1.11; FC: 0.5; IBV: 0.001; ISR: 1e-14; MJSW: 0.33; NTUN: 30; TNOM: 27; XTI: 3; SimulationGenericComponent: True; CJO: 0; CJP: 0; CTA: 0; CTP: 0; FCS: 0.5; FV_MAX: 1e99; IKF: 0; IKR: 0; JSW: 0; JTUN: 0; JTUNSW: 0; KEG: 1; KF: 0; LEVEL: 1; N: 1; NBV: 1; NR: 1; NS: 1; PHP: 1; RS: 0; TCV: 0; TLEV: 0; TLEVC: 0; TM1: 0; TM2: 0; TPB: 0; TPHP: 0; TRS: 0; TRS2: 0; TT: 0; TTT1: 0; TTT2: 0; VJ: 1; XTITUN: 3; IS: 1e-14
HV_Box = HV_Box
Littelfuse_?#1 Littelfuse_?#2 = Fuse: RESISTANCE: 1m; SimulationGenericComponent: True
R?#1-R?#4 RXG? 人体保护电阻+ 人体保护电阻- 放电电阻1 放电电阻2 = Resistor: TC1: 0; SimulationGenericComponent: True; TC2: 0
主正继电器? 主负继电器? 预充继电器? = DPST Relay: L_C: 1u; R_C: 100; RON: 1; ROFF: 1e12; ION: 1m; IOFF: 0; SimulationGenericComponent: True
低压盒 = Low_Vol_Box_New